# Altium project InactivityTracker.PrjPcb
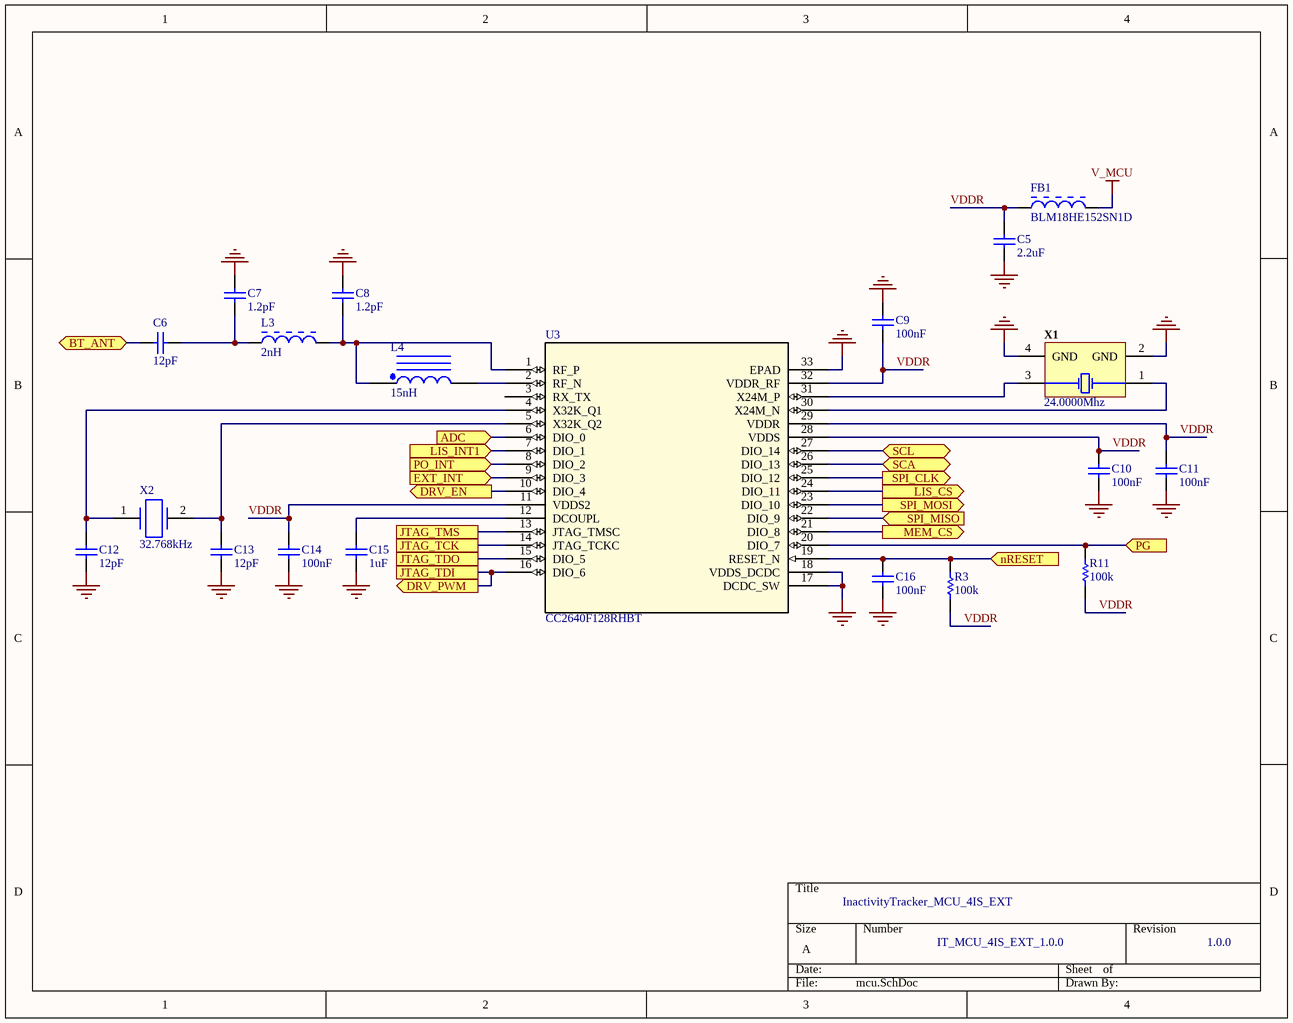
[diagram p0: mcu.SchDoc]
7 sheets, 68 parts. Net scope: flat (ports and power ports of the same name join across sheets).
Board files: InactivityTracker.PcbDoc, InactivityTracker_rev4_pcituremode.PcbDoc
Sheets:
  mcu.SchDoc
  power-dist.SchDoc
  lipo-charger.SchDoc
  pulseox.SchDoc
  peripherals.SchDoc
  hid.SchDoc
  memory.SchDoc

## Sheet mcu.SchDoc
size A

### Parts
C5  2.2uF  [CAPC1005X55X25ML05T10]
C6  12pF  [CAPC1005X55X25NL05T10]
C7  1.2pF  [CAPC1005X55X25ML05T10]
C8  1.2pF  [CAPC1005X55X25ML05T10]
C9  100nF  [CAPC1005X55X25NL05T10]
C10  100nF  [CAPC1005X55X25NL05T10]
C11  100nF  [CAPC1005X55X25NL05T10]
C12  12pF  [CAPC1005X55X25NL05T10]
C13  12pF  [CAPC1005X55X25NL05T10]
C14  100nF  [CAPC1005X55X25NL05T10]
C15  1uF  [CAPC1005X55X25NL5T10]
C16  100nF  [CAPC1005X55X25NL05T10]
FB1  BLM18HE152SN1D  [MURA-BLM18-RF-H4-CHIP-2_V]
L3  2nH  [MURA-IND0402_V]
L4  15nH  [INDC1005X55X25ML05T10_A]
R3  100k  [RESC1005X40X25ML05T05]
R11  100k  [RESC1005X40X25ML05T05]
U3  CC2640F128RHBT  [RHB32_3P45X3P45]
X1  24.0000Mhz  [EPSON-TSX-3225_V]
X2  32.768kHz  [XTAL320X150X75]

### Ports
ADC (in), BT_ANT (bidir), DRV_EN (out), DRV_PWM (out), EXT_INT (in), JTAG_TCK, JTAG_TDI, JTAG_TDO, JTAG_TMS, LIS_CS (out), LIS_INT1 (in), MEM_CS (out), nRESET (in), PG (in), PO_INT (in), SCA (bidir), SCL (bidir), SPI_CLK (out), SPI_MISO (in), SPI_MOSI (out)

### Nets
GND: C5.2 C7.1 C8.1 C9.2 C10.1 C11.1 C12.1 C13.1 C14.1 C15.2 C16.1 U3.17(DCDC_SW) U3.18(VDDS_DCDC) U3.33(EPAD) X1.2(GND) X1.4(GND)
V_MCU: FB1.2
VDDR: C5.1 C9.1 C10.2 C11.2 C14.2 FB1.1 R3.2 R11.2 U3.11(VDDS2) U3.28(VDDS) U3.29(VDDR) U3.32(VDDR_RF)
NetAE1_1: C6.1 ; port BT_ANT
NetC6_2: C6.2 C7.2 L3.1
NetC8_2: C8.2 L3.2 L4.1 U3.1(RF_P)
NetC12_2: C12.2 U3.4(X32K_Q1) X2.1
NetC13_2: C13.2 U3.5(X32K_Q2) X2.2
NetC15_1: C15.1 U3.12(DCOUPL)
NetC16_2: C16.2 R3.1 U3.19(RESET_N) ; port nRESET
NetL4_2: L4.2 U3.2(RF_N)
NetP3_1: U3.26(DIO_13) ; port SCA
NetP3_2: U3.27(DIO_14) ; port SCL
NetP3_5: U3.8(DIO_2) ; port PO_INT
NetP4_1: U3.9(DIO_3) ; port EXT_INT
NetP5_1: U3.13(JTAG_TMSC) ; port JTAG_TMS
NetP5_2: U3.14(JTAG_TCKC) ; port JTAG_TCK
NetP5_3: U3.15(DIO_5) ; port JTAG_TDO
NetP5_4: U3.16(DIO_6) ; port JTAG_TDI, port DRV_PWM
NetR1_2: U3.6(DIO_0) ; port ADC
NetR11_1: R11.1 U3.20(DIO_7) ; port PG
NetU3_7: U3.7(DIO_1) ; port LIS_INT1
NetU3_10: U3.10(DIO_4) ; port DRV_EN
NetU3_21: U3.21(DIO_8) ; port MEM_CS
NetU3_22: U3.22(DIO_9) ; port SPI_MISO
NetU3_23: U3.23(DIO_10) ; port SPI_MOSI
NetU3_24: U3.24(DIO_11) ; port LIS_CS
NetU3_25: U3.25(DIO_12) ; port SPI_CLK
NetU3_30: U3.30(X24M_N) X1.1(X1)
NetU3_31: U3.31(X24M_P) X1.3(X2)

Not connected (* = marked no-connect by the designer): U3 3(RX_TX)

### Notes on the sheet
- InactivityTracker_MCU_4IS_EXT
- IT_MCU_4IS_EXT_1.0.0
- 1.0.0

### Library data of the parts
C5 = CMP-2008-04543-1: Part Number: GRM155R60J225ME15D; Manufacturer: Murata
C6 C12 C13 = CMP-2008-04258-1: Part Number: GRM1555C1H120JA01D; Manufacturer: Murata
C7 C8 = CMP-2008-04281-1: Manufacturer: Murata; Part Number: GRM1555C1H1R2CA01D
C9-C11 C14 C16 = CMP-2008-04639-1: Part Number: GRM155R71H104KE14D; Manufacturer: Murata
C15 = CMP-1662-00020-1: Chip Capacitor, 1 uF, +/- 10%, 6.3 V, -55 to 85 degC, 0402 (1005 Metric), RoHS, Tape and Reel; PartNumber: GRM155R60J105KE19D; Voltage Rating (DC): 3 V; Type (Capacitors): X5R; Voltage Rating: 6.3 V; ComponentLink2Description: Datasheet; ComponentLink2URL: http://psearch.en.murata.com/capacitor/product/GRM155R60J105KE19%23.pdf; Max Operating Temperature: 85 degC; Min Operating Temperature: -55 degC; Package Quantity: 10000; Mounting Technology: Surface Mount; ComponentLink1Description: Manufacturer URL; ComponentLink1URL: http://www.murata.com/; PackageDescription: 2-Pin Surface Mount Device, Body 1 x 0.5 mm; Tolerance: 10%; Case/Package: 0402; Mount: Surface Mount; Packaging: Tape and Reel; Case Code (Metric): 1005; Radiation Hardening: No; Width: 0.5 mm; Length: 1 mm; DatasheetVersion: 08/2016; Height: 0.5 mm; Capacitance: 1 uF; RoHSCompliant: true; Case Code (Imperial): 0402; REACH SVHC: No SVHC; Pins: 2
FB1 = CMP-0686-00368-2: Chip Ferrite Bead for GHz Band High-speed Signal Lines, 1500 Ohm, 500 mA, -55 to 125 degC, 1.6 x 0.8 x 0.95 mm SMD, Tape and Reel; Manufacturer: Murata; Rated Current: 500 mA; Impedance (at 100 MHz): 1500 Ohm +/- 25%; DC Resistance: 0.50 Ohm Max.; Packing: Tape and Reel; DatasheetVersion: 08/2013; ComponentLink1URL: http://www.murata.com/; Mounting Technology: Surface Mount; ComponentLink2URL: http://www.murata.com/products/catalog/pdf/c31e.pdf; ComponentLink3Description: Package Specification; ComponentLink2Description: Datasheet; PackageReference: BLM18_H950-2; ComponentLink1Description: Manufacturer URL; PackageDescription: 2-Pin Chip, Body 1.6 x 0.8 mm; ComponentLink3URL: http://www.murata.com/products/catalog/pdf/c31e.pdf; PartNumber: BLM18HE152SN1D; Operating Temperature Range: -55 to 125 degC
L3 = CMP-0499-00001-3: Chip Inductor (Chip Coil) for High Frequency Multilayer, 2 +/- 0.3 nH, 300 mA, 0402 (1005), 180mm Paper Tape; Manufacturer: Murata; PartNumber: LQG15HS2N0S02D; Self Resonance Frequency (min.): 6000 MHz; Inductance Test Frequency: 100 MHz; Inductance: 2.0 nH +/- 0.3 nH; Rated Current (Itemp) (Based on Temperature rise): 300 mA; Max. Of DC Resistance: 0.1 ohm; Q (min.): 8; Operating Temperature Range: -55 to 125 degC; Mounting Technology: Surface Mount; PackageDescription: 2-Pin SMT Inductor, 1 x 0.5 mm Body; ComponentLink2URL: http://search.murata.co.jp/Ceramy/image/img/PDF/ENG/L0075S0083LQG15HS.pdf; ComponentLink1Description: Manufacturer URL; ComponentLink3URL: http://search.murata.co.jp/Ceramy/image/img/PDF/ENG/L0075S0083LQG15HS.pdf; ComponentLink1URL: http://www.murata.com/; ComponentLink2Description: Datasheet; RoHS: Yes; ComponentLink3Description: Package Specification; Q Test Frequency: 100 MHz; PackageReference: IND0402
L4 = CMP-2100-03652-1: Chip Inductor, 15 nH, +/- 5%, 100 MHz, -55 to 125 degC, 0402 (1005 Metric), RoHS, Paper Tape; Manufacturer: Murata; DC Current: 300mA; Q Factor: 8; Self Resonant Frequency: 2.5GHz; DC Resistance (DCR): 320mOhm; Test Frequency: 100MHz; Shielding: Unshielded; Core Material: Air; Lead Free: LeadFree; Package Quantity: 10000; Package Description: 2-Pin Surface Mount Device, Body 1 x 0.5 mm; Case Code (Imperial): 0402; Termination: SMD/SMT; Datasheet URL: http://psearch.en.murata.com/inductor/product/LQG15HS15NJ02_.pdf; Case Code (Metric): 1005; Tolerance: 5%; Min Operating Temperature: -55degC; Radiation Hardening: No; Width: 0.02inch; Current Rating: 300mA; Packaging: TapeandReel; Height: 0.5mm; Manufacturer URL: http://www.murata.com/; Case/Package: 0402; Max DC Current: 300mA; Height - Seated (Max): 0.022inch; Package Reference: 0402; Length: 1mm; Max Operating Temperature: 125degC; Military Standard: Not; Datasheet Version: 42675.0; Depth: 0.55mm; Inductance: 15nh; RoHSCompliant: true
R3 R11 = CMP-2002-08123-2: Chip Resistor, 100 KOhm, +/- 1%, 0.63 W, -55 to 155 degC, 0402 (1005 Metric), RoHS, Tape and Reel; Voltage Rating: 50 V; Type (Resistor): Thick Film; Power Rating: 63 mW; Case\Package: 0402; Mount: Surface Mount; Packaging: Tape and Reel; Weight: 2.3E-05 oz; PackageDescription: 2-Pin Surface Mount Device, Body 1 x 0.5 mm; ComponentLink1Description: Manufacturer URL; ComponentLink2Description: Datasheet; Min Operating Temperature: -55 degC; Width: 0.5 mm; Resistance: 100 kohm; REACH SVHC: Unknown; ComponentLink2URL: http://www.vishay.com/docs/20035/dcrcwe3.pdf; Package Quantity: 10000; Mounting Technology: Surface Mount; PackageReference: 0402; ComponentLink1URL: http://www.vishay.com/; Max Operating Temperature: 155 degC; Length: 1 mm; DatasheetVersion: 06/2012; Height: 0.35 mm; Case Code (Imperial): 0402; Pins: 2; Tolerance: 1%; Case Code (Metric): 1005; Radiation Hardening: No; RoHSCompliant: true
U3 = CC2640F128RHBT: SimpleLink Wireless MCU; Vendor: Texas Instruments; Built_By: EMA_Jessica; Manufacturer_Part_Number: CC2640F128RHBT; Copyright: Copyright (C) 2018 Accelerated Designs. All rights reserved; RefDes: RefDes; Type: DEV; Value: Value
X1 = CMP-2000-07333-1: MHz Range Crystal, 24 MHz, -40 to 85 degC, 4-Pin SMD, RoHS, Tape and Reel; Manufacturer: Epson; Brand: EpsonTiming; Frequency Stability: 10PPM; Frequency: 24MHz; ESR: 40Ohms; Load Capacitance: 9pF; Unit Weight: 0.000564oz; Drive Level: 200uW; Datasheet Version: 12/2015; RoHS: True; Operating Temperature Range: -40Cto+85C; Length: 3.2mm; Tolerance: 10PPM; Width: 2.5mm; Mounting Technology: SurfaceMount; Package Description: 4-Pin Surface Mount Device, Body 3.2 x 2.5 mm; Manufacturer URL: https://www.eea.epson.com/; Factory Pack Quantity: 250; Package Reference: TSX-3225; Height: 0.6mm; Mounting Style: SMD/SMT; Termination Style: SMD/SMT; Datasheet URL: https://support.epson.biz/td/api/doc_check.php?dl=brief_FA-238V_en.pdf; Type: Crystal; Series: TSX-3225; Package / Case: 3.2mmx2.5mm; Product Category: Crystals; Packaging: Reel
X2 = 9HT10-32.768KDZY-T: TXC - 9HT10-32.768KDZY-T - CRYSTAL, 32.768KHZ, 7PF, 3.2 X 1.5MM; Tolerance: 20ppm; ESR (Equivalent Series Resistance): 70kR; Supplier 1: Digi-Key; Manufacturer: TXC; Manufacturer Part Number: 9HT10-32.768KDZY-T; RoHS: Yes; Category: Crystals; Stock 1: 3909; Pricing 1: 1=0.66000, 10=0.55000, 50=0.49500, 100=0.44000, 500=0.41800, 1000=0.35200 (USD); Mount: Surface Mount; Case/Package: SMD/SMT; Number of Pins: 2; Min Operating Temperature: -40°C; Max Operating Temperature: 85°C; Termination: SMD/SMT; Package Quantity: 1; Frequency: 32.768kHz; Load Capacitance: 7pF; Packaging: Tape and Reel; Frequency Tolerance: 20ppm; Length: 0.126inch; Height: 0.033inch; Width: 1.5mm; Lead Free: Lead Free; REACH SVHC: No SVHC; ComponentLink1URL: https://datasheet.ciiva.com/856/9ht10-856052.pdf?src-supplier=Digi-Key; ComponentLink1Description: https://datasheet.ciiva.com/856/9ht10-856052.pdf?src-supplier=Digi-Key; ComponentLink2URL: https://datasheet.ciiva.com/856/9ht10-856053.pdf?src-supplier=Digi-Key; ComponentLink2Description: https://datasheet.ciiva.com/856/9ht10-856053.pdf?src-supplier=Digi-Key; ComponentLink3URL: https://datasheet.ciiva.com/8047/9ht10-8047909.pdf?src-supplier=Element14; ComponentLink3Description: https://datasheet.ciiva.com/8047/9ht10-8047909.pdf?src-supplier=Element14; ComponentLink4URL: https://datasheet.ciiva.com/856/9ht10-856054.pdf?src-supplier=Digi-Key; ComponentLink4Description: https://datasheet.ciiva.com/856/9ht10-856054.pdf?src-supplier=Digi-Key; Supplier Part Number 1: 887-1506-1-ND

## Sheet power-dist.SchDoc
size A
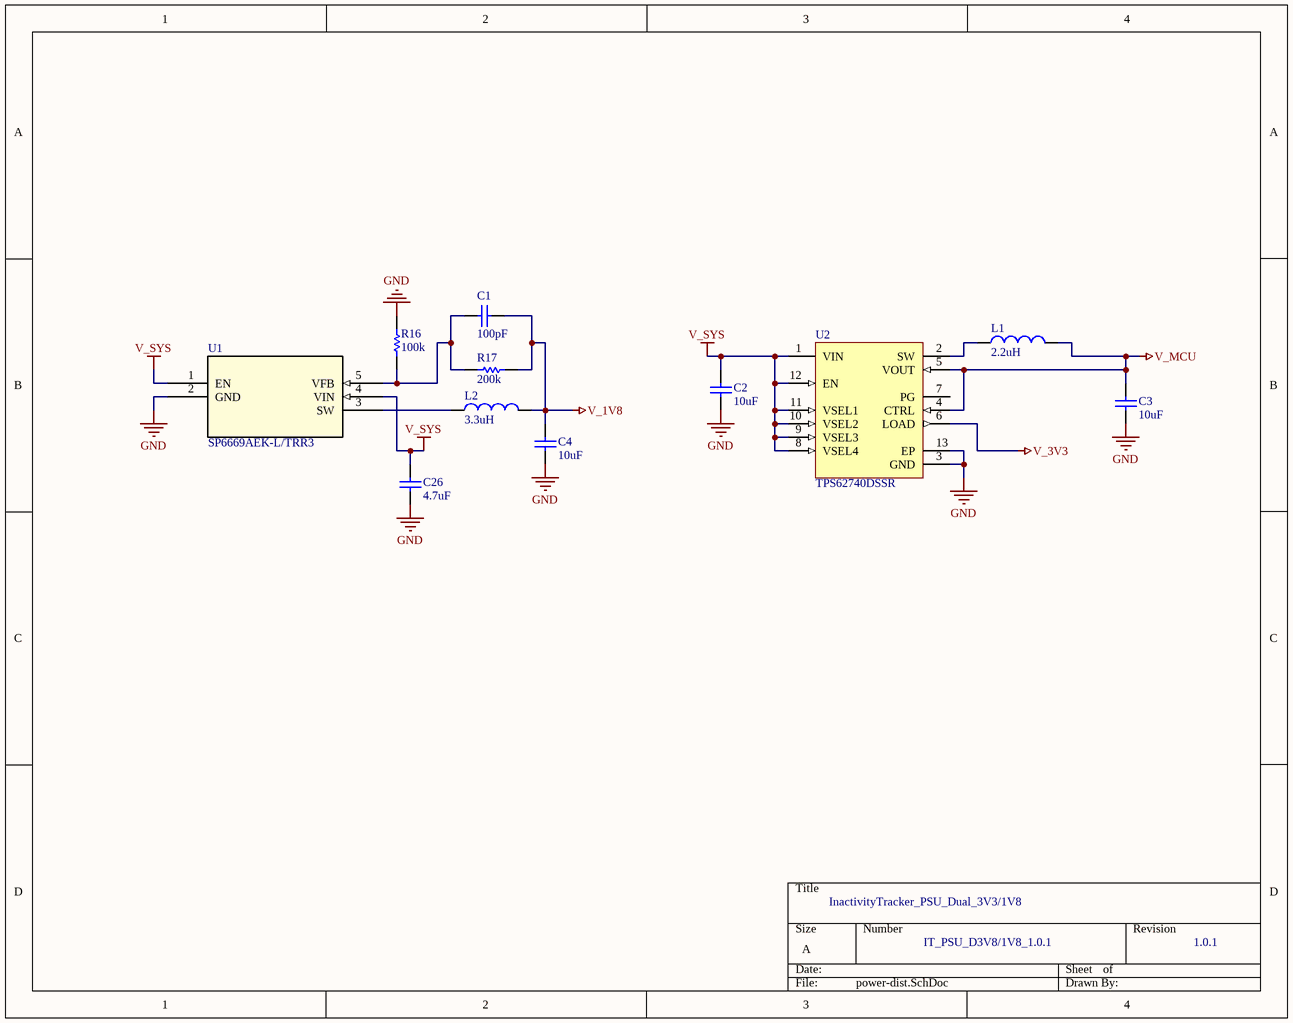
[diagram p1: power-dist.SchDoc]

### Parts
C1  100pF  [CAPC1005X55X25ML05T10]
C2  10uF  [CAPC1005X55X25NL05T10]
C3  10uF  [CAPC1005X55X25NL05T10]
C4  10uF  [CAPC1005X55X25NL05T10]
C26  4.7uF  [CAPC1005X55X25NL05T10]
L1  2.2uH  [MURA-IND0805_H_0.55_L]
L2  3.3uH  [INDC2012X100N]
R16  100k  [RESC1005X40X25ML05T05]
R17  200k  [RESC1005X40X25ML05T05]
U1  SP6669AEK-L/TRR3  [SOT-23-5_VAR-AA]
U2  TPS62740DSSR  [DSS0012A_V]

### Nets
GND: C2.2 C3.2 C4.2 C26.2 R16.1 U1.2(GND) U2.3(GND) U2.13(EP)
V_1V8: C1.2 C4.1 L2.2 R17.2
V_3V3: U2.6(LOAD)
V_MCU: C3.1 L1.2 U2.4(CTRL) U2.5(VOUT)
V_SYS: C2.1 C26.1 U1.1(EN) U1.4(VIN) U2.1(VIN) U2.8(VSEL4) U2.9(VSEL3) U2.10(VSEL2) U2.11(VSEL1) U2.12(EN)
NetC1_1: C1.1 R16.2 R17.1 U1.5(VFB)
NetL1_1: L1.1 U2.2(SW)
NetL2_1: L2.1 U1.3(SW)

Not connected (* = marked no-connect by the designer): U2 7(PG)

### Notes on the sheet
- InactivityTracker_PSU_Dual_3V3/1V8
- IT_PSU_D3V8/1V8_1.0.1
- 1.0.1

### Library data of the parts
C1 = CMP-2008-04249-1: Manufacturer: Murata; Part Number: GRM1555C1H101GA01D
C2-C4 = CMP-2008-04556-1: Part Number: GRM155R61A105KE15D; Manufacturer: Murata
C26 = CMP-2008-03967-1: Manufacturer: Murata; Part Number: GRM155R61C102KA01D
L1 = CMP-2000-06589-1: Chip Inductor, 1.0 uH, +/- 20%, -55 to 125 degC, 2-Pin SMD (0805), RoHS, Tape and Reel; Manufacturer: Murata; Rated Current-Max: 800mA; Inductance-Nom: 1H; DC Resistance: 0.19; Mounting Technology: SurfaceMount; Package Reference: 0805; Tolerance (%): 20%; Datasheet Version: 07/2014; Manufacturer URL: http://www.murata.com/; Package Description: 2-Pin Surface Mounted Device, Body 2 x 1.25 mm; Case Size/Dimension: 0805; Datasheet URL: https://datasheet.ciiva.com/3866/336lqm21pn1r0mc023-3866307.pdf
L2 = LQM21PN3R3NGRD: Inductor with Inductance: 3.3uH Tol. +/-30%, Package: 0805 _2012_; MF: Murata; Digi-Key_Purchase_URL: https://www.digikey.com/product-detail/en/murata-electronics/LQM21PN3R3NGRD/490-11718-1-ND/5333558?utm_source=snapeda&utm_medium=aggregator&utm_campaign=symbol; Value: *; Digi-Key_Part_Number: 490-11718-1-ND; SnapEDA_Link: https://www.snapeda.com/parts/LQM21PN3R3NGRD/Murata%20Electronics%20North%20America/view-part/1523369/?ref=snap; Package: 2012 Murata; MP: LQM21PN3R3NGRD
R16 = CMP-2002-08123-2: as R3 on sheet mcu; Mount: Surface Mount; Packaging: Tape and Reel; Weight: 2.3E-05 oz; PackageDescription: 2-Pin Surface Mount Device, Body 1 x 0.5 mm; ComponentLink1Description: Manufacturer URL; ComponentLink2Description: Datasheet; Min Operating Temperature: -55 degC; Width: 0.5 mm; Resistance: 100 kohm; REACH SVHC: Unknown; ComponentLink2URL: http://www.vishay.com/docs/20035/dcrcwe3.pdf; Package Quantity: 10000; Mounting Technology: Surface Mount; PackageReference: 0402; ComponentLink1URL: http://www.vishay.com/; Max Operating Temperature: 155 degC; Length: 1 mm; DatasheetVersion: 06/2012; Height: 0.35 mm; Case Code (Imperial): 0402; Pins: 2; Tolerance: 1%; Case Code (Metric): 1005; Radiation Hardening: No; RoHSCompliant: true
R17 = CMP-2002-08351-1: Part Number: CRCW0402200RFKED; Manufacturer: Vishay Dale
U1 = SP6669AEK-L/TRR3: Buck Switching Regulator IC Positive Adjustable 0.6V 1 Output 600mA SC-74A, SOT-753; Vendor: Exar; Built_By: EMA_Jessica; Manufacturer_Part_Number: SP6669AEK-L/TRR3; Copyright: Copyright (C) 2018 Accelerated Designs. All rights reserved; RefDes: RefDes; Type: DEV; Value: Value
U2 = CMP-0323-00572-2: Step Down Converter For Low Power Applications, 2.2 to 5.5 V VIN, -40 to 85 degC, 12-Pin WSON (DSS), RoHS, Tape and Reel; VOUT Max: 3.3 V; VIN Min: 2.2 V; VIN Max: 5.5 V; VOUT Min: 1.8 V; ComponentLink1URL: http://www.ti.com/; PackageReference: DSS0012A; ComponentLink2URL: http://www.ti.com/lit/ds/symlink/tps62740.pdf; Packing: Tape and Reel; DatasheetVersion: SLVSB02B; ComponentLink3Description: Package Specification; Temperature Max: 85 degC; RoHS: TRUE; PartNumber: TPS62740; PackageVersion: 4209244/C, 07/2011; PackageDescription: 12-Pin Plastic Small Outline, Body 3 x 2 mm, Pitch 0.5 mm; Mounting Technology: Surface Mount; ComponentLink1Description: Manufacturer URL; Temperature Min: -40 degC; ComponentLink2Description: Datasheet; ComponentLink3URL: http://www.ti.com/litv/pdf/mpds336b

## Sheet lipo-charger.SchDoc
size A
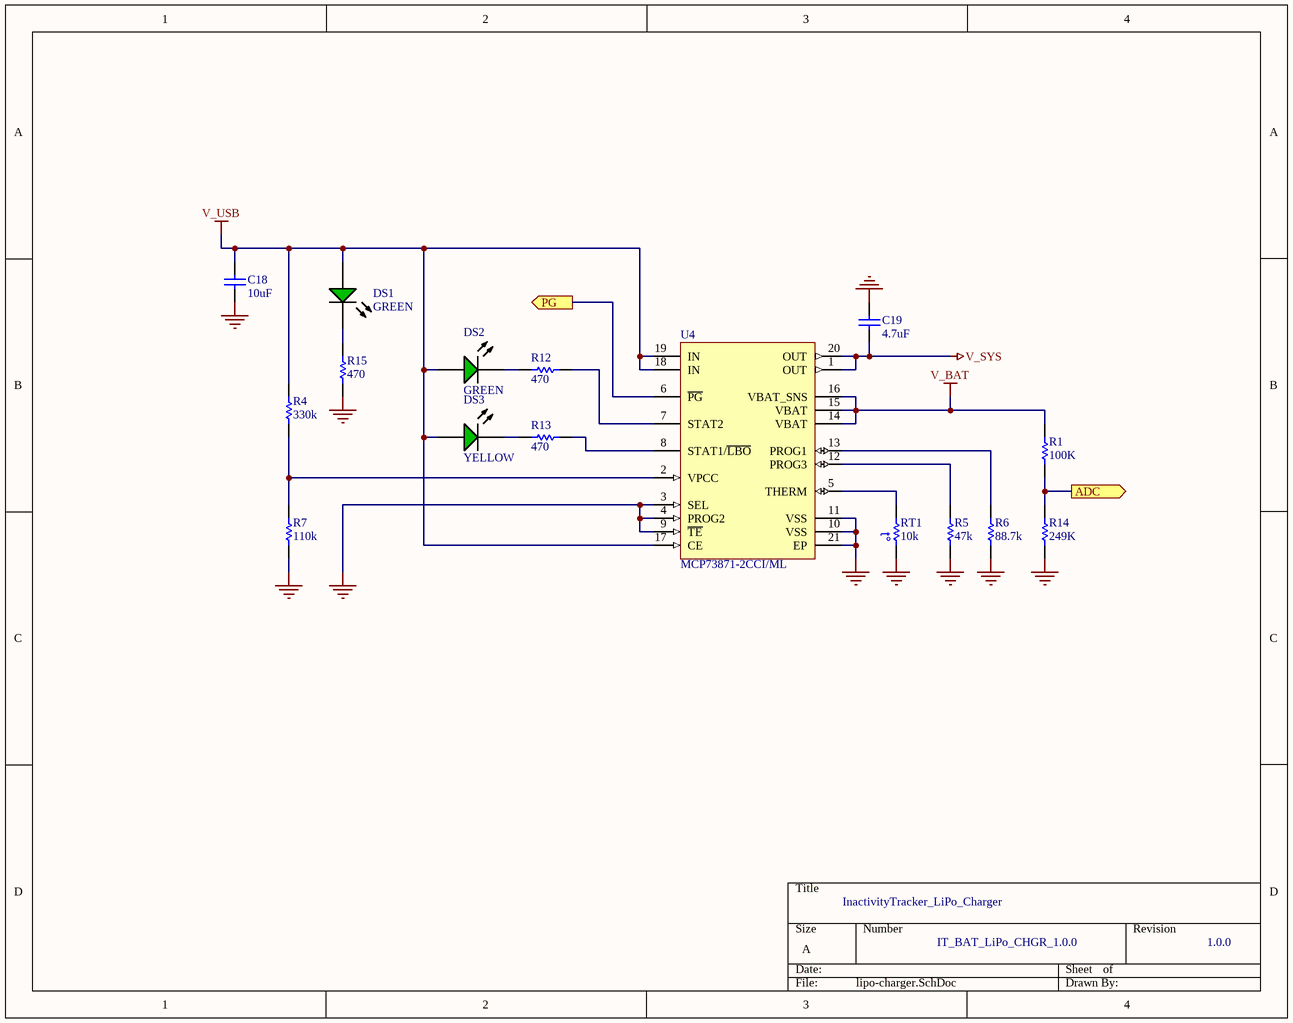
[diagram p2: lipo-charger.SchDoc]

### Parts
C18  10uF  [CAPC1005X55X25NL05T10]
C19  4.7uF  [CAPC1005X55X25NL05T10]
DS1  GREEN  [LITE-ON-LTST-C190GKT-2_V]
DS2  GREEN  [LITE-ON-LTST-C190GKT-2_V]
DS3  YELLOW  [LITE-ON-LTST-C190GKT-2_V]
R1  100K  [RESC1005X40X25ML05T05]
R4  330k  [RESC1005X40X25NL05T05]
R5  47k  [RESC1005X40X25LL05T05]
R6  88.7k  [RESC1005X40X25NL05T05]
R7  110k  [RESC1005X40X25NL05T05]
R12  470  [RESC1005X40X25ML05T05]
R13  470  [RESC1005X40X25ML05T05]
R14  249K  [RESC1005X40X25NL05T05]
R15  470  [RESC1005X40X25ML05T05]
RT1  10k  [MURA-NCP18XH103F03RB-2_V]
U4  MCP73871-2CCI/ML  [QFN-ML20_M]

### Ports
ADC (out), PG (out)

### Nets
GND: C18.2 C19.2 R5.2 R6.1 R7.2 R14.2 R15.2 RT1.2 U4.3(SEL) U4.4(PROG2) U4.9(~{TE}) U4.10(VSS) U4.11(VSS) U4.21(EP)
V_BAT: R1.1 U4.14(VBAT) U4.15(VBAT) U4.16(VBAT_SNS)
V_SYS: C19.1 U4.1(OUT) U4.20(OUT)
V_USB: C18.1 DS1.1(A) DS2.1(A) DS3.1(A) R4.1 U4.17(CE) U4.18(IN) U4.19(IN)
NetDS1_2: DS1.2(K) R15.1
NetDS2_2: DS2.2(K) R12.1
NetDS3_2: DS3.2(K) R13.1
NetR1_2: R1.2 R14.1 ; port ADC
NetR4_2: R4.2 R7.1 U4.2(VPCC)
NetR5_1: R5.1 U4.12(PROG3)
NetR6_2: R6.2 U4.13(PROG1)
NetR11_1: U4.6(~{PG}) ; port PG
NetR12_2: R12.2 U4.7(STAT2)
NetR13_2: R13.2 U4.8(STAT1/~{LBO})
NetRT1_1: RT1.1 U4.5(THERM)

### Notes on the sheet
- InactivityTracker_LiPo_Charger
- IT_BAT_LiPo_CHGR_1.0.0
- 1.0.0
- (in symbol CMP-2000-05271-1) t°

### Library data of the parts
C18 = CMP-2008-04556-1: as C2 on sheet power-dist
C19 = CMP-2008-03967-1: as C26 on sheet power-dist
DS1-DS3 = CMP-2000-05197-1: LED Uni-Color Green, 75 mW, 5 V, -30 to 85 degC, 2-Pin SMD, RoHS, Tape and Reel; Manufacturer: Lite-On; Reverse Voltage: 5V; Product Depth (mm): 0.8mm; Forward Voltage: 2.4V; Rad Hardened: No; High Brightness: Yes; Forward Current: 30mA; Viewing Angle: 130deg; Test Current (It): 20mA; Emitting Color: YellowGreen; Number of Elements: 1; Luminous Intensity: 35mcd; Chip Material: AlGaInP; Shape Type: Rectangular; Dominant Wave Length: 571nm; Peak Wavelength: 574nm; Main Category: ChipLED; DELETED: Compliant; Product Length (mm): 1.6mm; Power Dissipation: 75W; Package Reference: C190KGKT; Mounting: SurfaceMount; Package Description: 2-Pin Surface Mount Device, Body 1.6 x 0.8 mm; Datasheet Version: Jul-15; Operating Temperature Classification: Industrial; Packaging: TapeandReel; Lens Dimensions: 1.1X0.8X0.52mm; Type: Uni-Color; Manufacturer URL: http://www.us.liteon.com/; Datasheet URL: http://datasheet.octopart.com/LTST-C190KGKT-Lite-On-datasheet-43775815.pdf; Product Height (mm): 0.8mm; Operating Temp Range: -55Cto85C; Pin Count: 2; Package Type: ChipLed; Lum Intensity: 35mcd
R1 = CMP-2002-08123-2: as R3 on sheet mcu; Mount: Surface Mount; Packaging: Tape and Reel; Weight: 2.3E-05 oz; PackageDescription: 2-Pin Surface Mount Device, Body 1 x 0.5 mm; ComponentLink1Description: Manufacturer URL; ComponentLink2Description: Datasheet; Min Operating Temperature: -55 degC; Width: 0.5 mm; Resistance: 100 kohm; REACH SVHC: Unknown; ComponentLink2URL: http://www.vishay.com/docs/20035/dcrcwe3.pdf; Package Quantity: 10000; Mounting Technology: Surface Mount; PackageReference: 0402; ComponentLink1URL: http://www.vishay.com/; Max Operating Temperature: 155 degC; Length: 1 mm; DatasheetVersion: 06/2012; Height: 0.35 mm; Case Code (Imperial): 0402; Pins: 2; Tolerance: 1%; Case Code (Metric): 1005; Radiation Hardening: No; RoHSCompliant: true
R4 = CMP-2002-08521-1: Manufacturer: Vishay Dale; Part Number: CRCW0402330KFKED
R5 = CMP-2002-00026-1: Manufacturer: Vishay Dale; Part Number: CRCW040247K0JNED
R6 = CMP-2002-00251-1: Manufacturer: Vishay Dale; Part Number: CRCW040288K7FKED
R7 = CMP-2002-08148-1: Manufacturer: Vishay Dale; Part Number: CRCW0402110KFKED
R12 R13 R15 = CMP-2002-00023-1: Part Number: CRCW0402470RJNED; Manufacturer: Vishay Dale
R14 = CMP-2002-08401-1: Part Number: CRCW0402249KFKED; Manufacturer: Vishay Dale
RT1 = CMP-2000-05271-1: NTC Thermistor, 10 KOhm, +/- 1%, 0.1 W, -40 to 125 degC, 0603 (1608 Metric), RoHS, Tape and Reel; Manufacturer: Murata; B-constant: 3434K; Resistance: 10kO; Rated Current: 310A; Datasheet URL: http://www.jameco.com/Jameco/Products/ProdDS/1870999.pdf; Datasheet Version: Apr-05; Temperature Range: -40to+125degC; Tolerance (%): ±1%; Manufacturer URL: http://www.murata.com/; Type: NTC
U4 = CMP-0133-00005-1: Stand-Alone System Load Sharing and Li-Ion/Li-Polymer Battery Charge Management Controller, 4.2V, 20-Pin QFN, Industrial Temperature; PackageDescription: 20-Lead Plastic Quad Flat, No Lead Package (ML) - 4x4x0.9 mm Body [QFN]; PackageReference: QFN-ML20; PackageVersion: revBB, Aug-2009; DatasheetVersion: revB, May-2009

## Sheet pulseox.SchDoc
size A
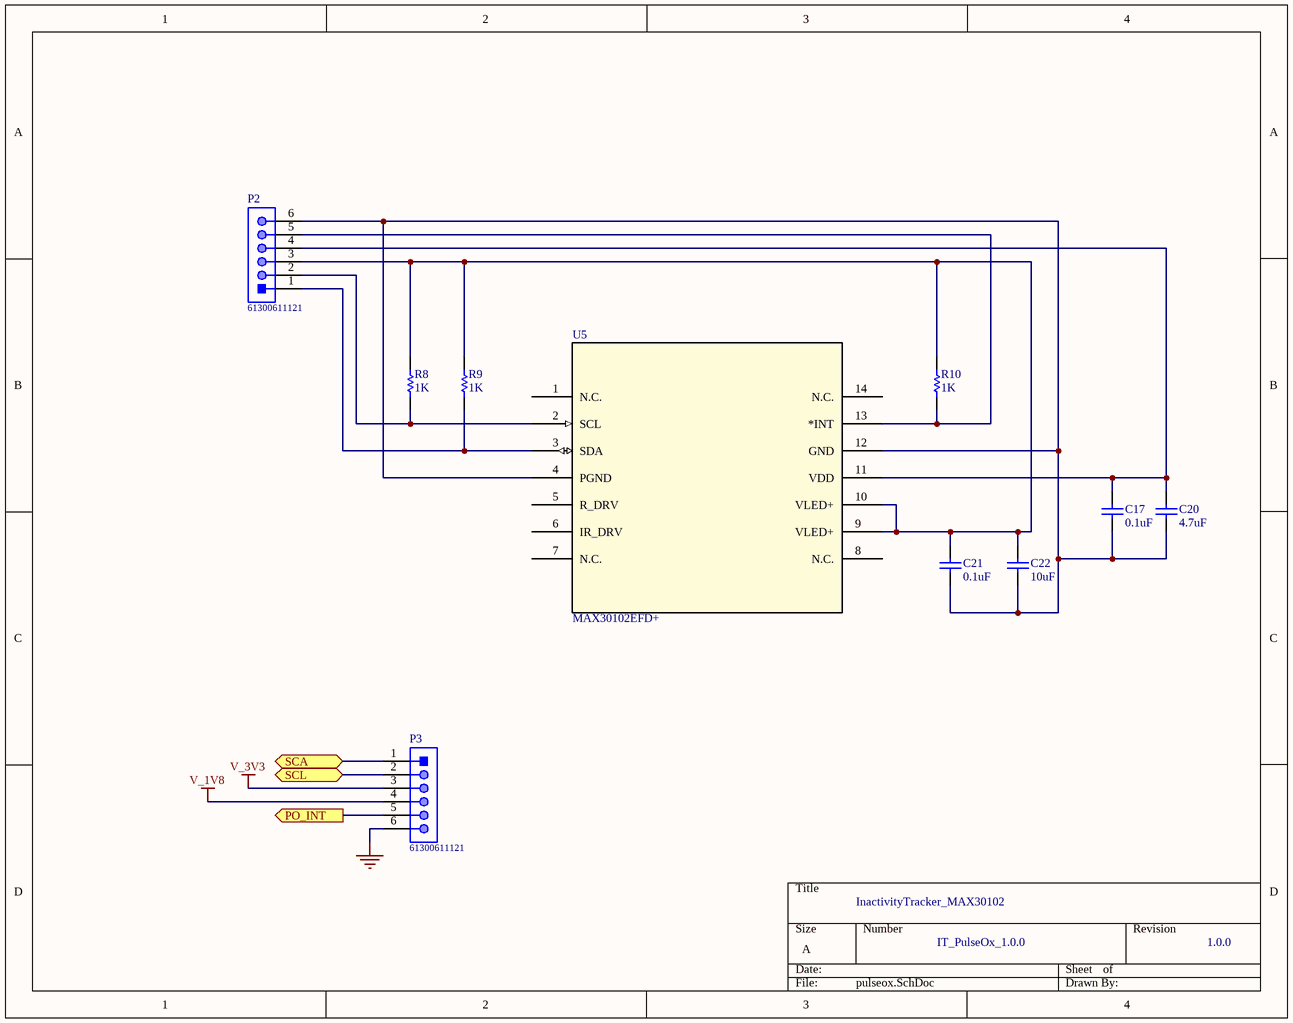
[diagram p3: pulseox.SchDoc]

### Parts
C17  0.1uF  [CAPC1005X55X25ML05T10]
C20  4.7uF  [CAPC1005X55X25NL05T10]
C21  0.1uF  [CAPC1005X55X25ML05T10]
C22  10uF  [CAPC1608X90X35NL10T15]
P2  61300611121  [61300611121]
P3  61300611121  [61300611121]
R8  1K  [RESC1005X40X25NL05T05]
R9  1K  [RESC1005X40X25NL05T05]
R10  1K  [RESC1005X40X25NL05T05]
U5  MAX30102EFD+  [21-0880B-L]

### Ports
PO_INT (out), SCA (bidir), SCL (bidir)

### Nets
GND: P3.6
V_1V8: P3.4
V_3V3: P3.3
NetC17_1: C17.1 C20.1 P2.4 U5.11(VDD)
NetC17_2: C17.2 C20.2 C21.2 C22.2 P2.6 U5.4(PGND) U5.12(GND)
NetC21_1: C21.1 C22.1 P2.3 R8.2 R9.2 R10.1 U5.9(VLED+) U5.10(VLED+)
NetP2_1: P2.1 R9.1 U5.3(SDA)
NetP2_2: P2.2 R8.1 U5.2(SCL)
NetP2_5: P2.5 R10.2 U5.13(*INT)
NetP3_1: P3.1 ; port SCA
NetP3_2: P3.2 ; port SCL
NetP3_5: P3.5 ; port PO_INT

Not connected (* = marked no-connect by the designer): U5 1(N.C.) 5(R_DRV) 6(IR_DRV) 7(N.C.) 8(N.C.) 14(N.C.)

### Notes on the sheet
- InactivityTracker_MAX30102
- IT_PulseOx_1.0.0
- 1.0.0

### Library data of the parts
C17 C21 = CMP-2100-03641-1: Chip Capacitor, 0.1 uF, +/- 10%, 16 V, -55 to 125 degC, 0402 (1005 Metric), RoHS, Tape and Reel; Manufacturer: Murata; Material: Ceramic; Insulation Resistance: 10GR; Voltage: 16V; Dielectric: X7R; Capacitance: 100nF; REACH SVHC: NoSVHC; Depth: 0.5mm; Case/Package: 0402; Datasheet URL: http://psearch.en.murata.com/capacitor/product/GRM155R71C104KA88%23.pdf; Lead Free: LeadFree; Dielectric Material: Ceramic; Manufacturer URL: http://www.murata.com/; Min Operating Temperature: -55degC; Length: 1mm; Case Code (Metric): 1005; Radiation Hardening: No; Package Reference: 0402; RoHSCompliant: true; Datasheet Version: 42675.0; Thickness: 0.022inch; Packaging: TapeandReel; Voltage Rating (DC): 16V; Tolerance: 10%; Max Operating Temperature: 125degC; Package Description: 2-Pin Surface Mount Device, Body 1 x 0.5 mm; Mount: SurfaceMount; Height: 0.5mm; Width: 0.5mm; Number of Pins: 2; Voltage Rating: 16V; Case Code (Imperial): 0402; Termination: SMD/SMT; Package Quantity: 1
C20 = CMP-2008-04549-1: Part Number: GRM155R60J475ME47D; Manufacturer: Murata
C22 = CMP-2006-02792-1: Part Number: GRM188R60J106ME47D; Manufacturer: Murata
P2 P3 = CMP-1502-01070-1: THT Vertical Pin Header WR-PHD, Pitch 2.54 mm, Single Row, 6 pins; Manufacturer: Wurth Elektronik; Gender: Male; Pin Number: 6; Pitch: 2.54mm; Working Voltage: 250VAC; Rated Current: 3A; Withstanding Voltage: 500VAC; Contact Resistance: 20mOhm; Operating Temperature: -40to105degC; Packaging: Bag; Datasheet URL: https://katalog.we-online.de/em/datasheet/6130xx11121.pdf; Package Reference: 61300611121; Mounting Technology: THT; Publisher: WurthElektronik; Part Number: 61300611121; Manufacturer URL: http://www.we-online.de; Row Number: Single; Orientation: Vertical
R8-R10 = CMP-2002-08276-1: Manufacturer: Vishay Dale; Part Number: CRCW04021K00FKED
U5 = MAX30102EFD+: IC SENSOR OXIMETER/HEARTRATE; Manufacturer: Maxim; Min Supply Voltage: 1.7V; Max Supply Voltage: 2V; Supplier 1: Digi-Key; Manufacturer Part Number: MAX30102EFD+; RoHS: Yes; Category: Decoders, Multiplexers; Stock 1: 798; Pricing 1: 1=9.76000, 10=8.81500, 25=8.40520, 100=7.29800, 500=6.35500, 1000=5.53500 (USD); Number of Pins: 14; Min Operating Temperature: -40°C; Max Operating Temperature: 85°C; REACH SVHC: No SVHC; ComponentLink1URL: http://www.farnell.com/datasheets/2162814.pdf?src-supplier=Farnell; ComponentLink1Description: http://www.farnell.com/datasheets/2162814.pdf?src-supplier=Farnell; ComponentLink2URL: http://www.farnell.com/datasheets/2162814.pdf?src-supplier=Element14; ComponentLink2Description: http://www.farnell.com/datasheets/2162814.pdf?src-supplier=Element14; ComponentLink3URL: https://datasheets.maximintegrated.com/en/ds/MAX30102.pdf?src-supplier=Digi-Key; ComponentLink3Description: https://datasheets.maximintegrated.com/en/ds/MAX30102.pdf?src-supplier=Digi-Key; Supplier Part Number 1: MAX30102EFD+-ND

## Sheet peripherals.SchDoc
size A
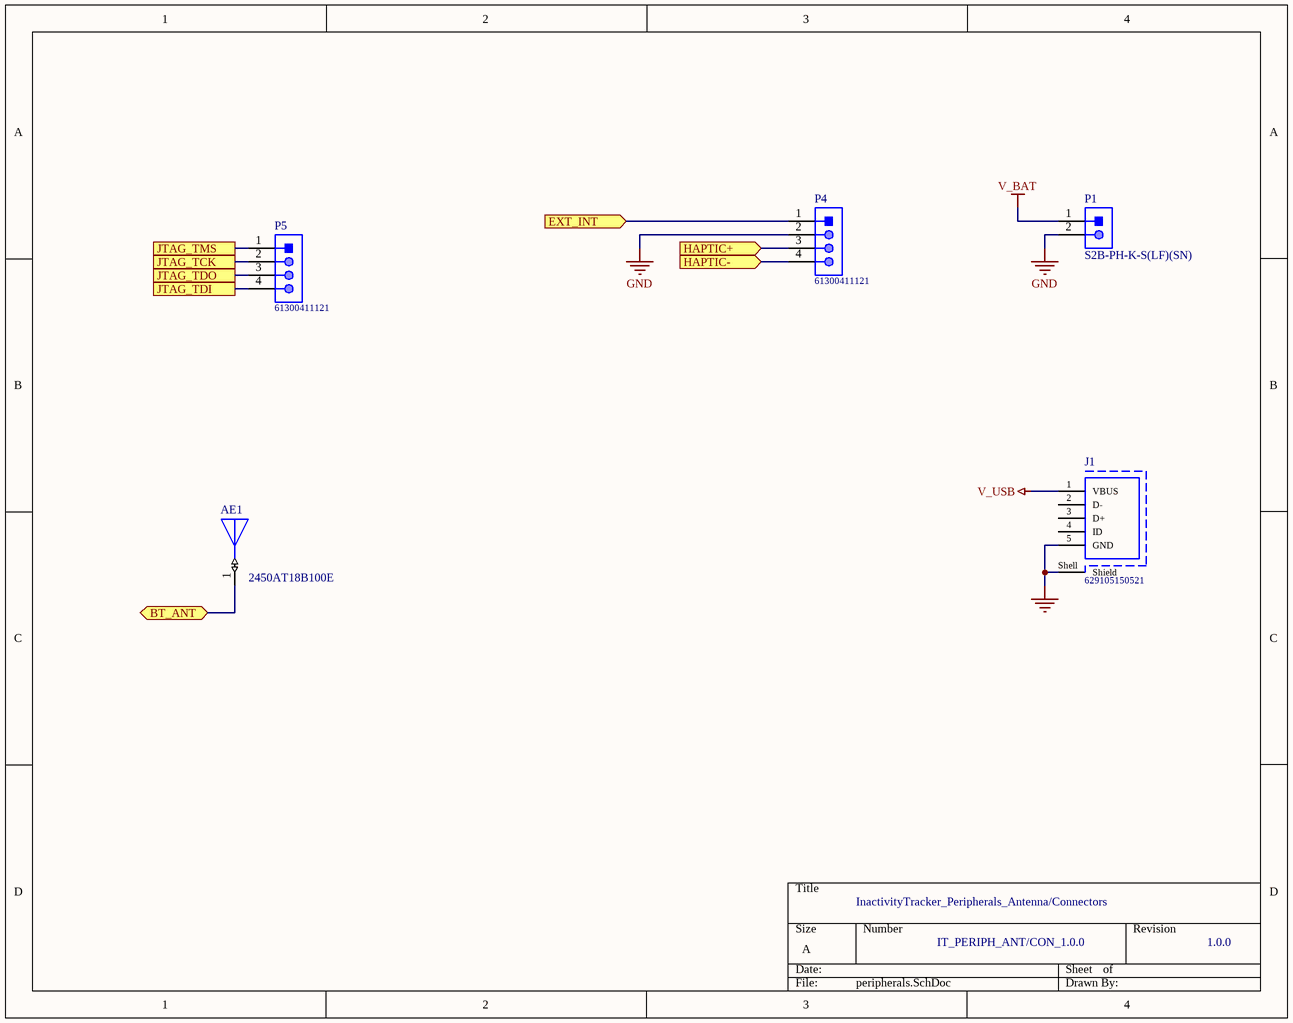
[diagram p4: peripherals.SchDoc]

### Parts
AE1  2450AT18B100E  [ANT_2450AT18B100E]
J1  629105150521  [629105150521]
P1  S2B-PH-K-S(LF)(SN)  [JST-S2B-PH-K-S_V]
P4  61300411121  [61300411121]
P5  61300411121  [61300411121]

### Ports
BT_ANT (bidir), EXT_INT (in), HAPTIC+ (in), HAPTIC- (in), JTAG_TCK, JTAG_TDI, JTAG_TDO, JTAG_TMS

### Nets
GND: J1.5(GND) J1.Shell(Shield) P1.2 P4.2
V_BAT: P1.1
V_USB: J1.1(VBUS)
NetAE1_1: AE1.1 ; port BT_ANT
NetP4_1: P4.1 ; port EXT_INT
NetP4_3: P4.3 ; port HAPTIC+
NetP4_4: P4.4 ; port HAPTIC-
NetP5_1: P5.1 ; port JTAG_TMS
NetP5_2: P5.2 ; port JTAG_TCK
NetP5_3: P5.3 ; port JTAG_TDO
NetP5_4: P5.4 ; port JTAG_TDI

Not connected (* = marked no-connect by the designer): J1 2(D-) 3(D+) 4(ID)

### Notes on the sheet
- InactivityTracker_Peripherals_Antenna/Connectors
- IT_PERIPH_ANT/CON_1.0.0
- 1.0.0

### Library data of the parts
AE1 = 2450AT18B100E: JOHANSON TECHNOLOGY - 2450AT18B100E - ANTENNA, CERAMIC, 2.45GHZ; Number of Bands: 1; Return Loss: -9.5dB; Max Power Dissipation: 3W; Max Frequency: 2.5GHz; Gain: -0.5dB; Impedance: 50R; Bandwidth: 100MHz; Supplier 1: Digi-Key; Manufacturer: Johanson; Manufacturer Part Number: 2450AT18B100E; RoHS: Yes; Category: RF Antennas; Stock 1: 218439; Pricing 1: 1=0.56000, 10=0.49500, 25=0.46520, 100=0.37950, 250=0.35252, 500=0.30000, 1000=0.24000 (USD); Mount: Surface Mount; Case/Package: CSMD; Contact Plating: Tin; Min Operating Temperature: -40°C; Max Operating Temperature: 85°C; Termination: Solder; Frequency: 2.45GHz; Package Quantity: 1; Packaging: Tape and Reel; Power Rating: 3W; Length: 3.2mm; Height: 0.051inch; Width: 1.6mm; Radiation Hardening: No; REACH SVHC: No SVHC; ComponentLink1URL: https://datasheet.ciiva.com/24025/antenna-2450at18b100-242422-24025839.pdf?src-supplier=Mouser; ComponentLink1Description: https://datasheet.ciiva.com/24025/antenna-2450at18b100-242422-24025839.pdf?src-supplier=Mouser; ComponentLink2URL: https://datasheet.ciiva.com/1124/1318299-1124918.pdf?src-supplier=Element14; ComponentLink2Description: https://datasheet.ciiva.com/1124/1318299-1124918.pdf?src-supplier=Element14; Supplier Part Number 1: 712-1006-1-ND
J1 = CMP-1502-03252-1: Micro USB 2.0 Type B Receptacle WR-COM, Horizontal, SMT, with Pegs, High Current at Pin 1 & Pin 5; Manufacturer: Wurth Elektronik; Contact Resistance: 30mOhm; Rated Current: 3A; Working Voltage: 30VAC; Package Reference: 629105150521; Mounting Technology: SMT; Connector Type: MicroUSB2.0TypeB; Operating Temperature: -40to85degC; Orientation: Horizontal; Manufacturer URL: http://www.we-online.de; Datasheet URL: https://katalog.we-online.de/em/datasheet/629105150521.pdf; Part Number: 629105150521; Packaging: TapeandReel; Gender: Receptacle; Publisher: WurthElektronik
P1 = CMP-1755-00004-1: Male Header, Pitch 2 mm, 1 x 2 Position, Height 4.8 mm, Tail Length 3.4 mm, -25 to 85 degC, RoHS, Bulk; Case\Package: Radial; Tolerance: 20%; Capacitance: 10 uF; Voltage Rating (DC): 50 V; Packaging: Bulk; ComponentLink1URL: http://www.jst-mfg.com/product/pdf/eng/ePH.pdf; Radiation Hardening: No; Height: 11 mm; Package Quantity: 200; PackageDescription: Male Header, Pitch 2 mm, 1 x 2 Position, Height 4.8 mm, Tail Length 3.4 mm; PackageReference: S2B-PH-K-S; Diameter: 5 mm; Pins: 2; Mount: Through Hole; Max Operating Temperature: 85 degC; Min Operating Temperature: -40 degC; ComponentLink1Description: Datasheet; DatasheetVersion: Dec-12; Length: 11 mm; Lead Pitch: 2 mm; REACH SVHC: No SVHC; Voltage Rating: 50 V; RoHSCompliant: true
P4 P5 = CMP-1502-01064-1: THT Vertical Pin Header WR-PHD, Pitch 2.54 mm, Single Row, 4 pins; Manufacturer: Wurth Elektronik; Withstanding Voltage: 500VAC; Rated Current: 3A; Working Voltage: 250VAC; Pin Number: 4; Gender: Male; Contact Resistance: 20mOhm; Pitch: 2.54mm; Manufacturer URL: http://www.we-online.de; Operating Temperature: -40to105degC; Packaging: Bag; Mounting Technology: THT; Package Reference: 61300411121; Datasheet URL: https://katalog.we-online.de/em/datasheet/6130xx11121.pdf; Publisher: WurthElektronik; Part Number: 61300411121; Row Number: Single; Orientation: Vertical

## Sheet hid.SchDoc
size A
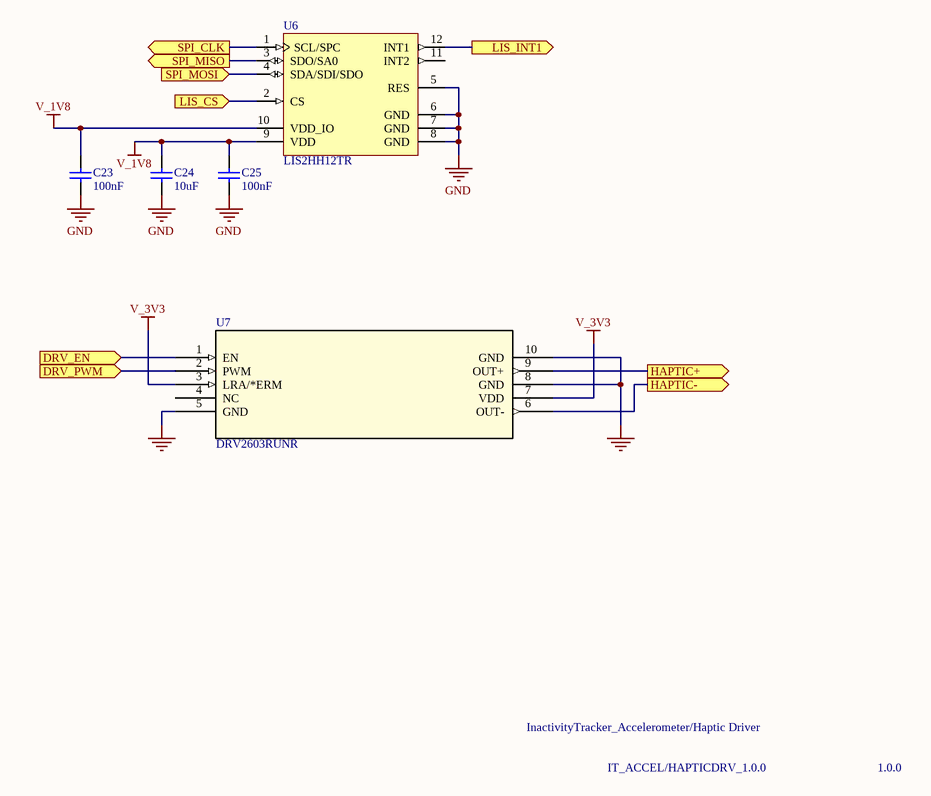
[diagram p5: hid.SchDoc]

### Parts
C23  100nF  [CAPC1005X55X25NL05T10]
C24  10uF  [CAPC1005X55X25NL05T10]
C25  100nF  [CAPC1005X55X25NL05T10]
U6  LIS2HH12TR  [STM-LGA-12]
U7  DRV2603RUNR  [RUN10]

### Ports
DRV_EN (in), DRV_PWM (in), HAPTIC+ (out), HAPTIC- (out), LIS_CS (in), LIS_INT1 (out), SPI_CLK (out), SPI_MISO (out), SPI_MOSI (in)

### Nets
GND: C23.1 C24.2 C25.1 U6.5(RES) U6.6(GND) U6.7(GND) U6.8(GND) U7.5(GND) U7.8(GND) U7.10(GND)
V_1V8: C23.2 C24.1 C25.2 U6.9(VDD) U6.10(VDD_IO)
V_3V3: U7.3(LRA/*ERM) U7.7(VDD)
NetP4_3: U7.9(OUT+) ; port HAPTIC+
NetP4_4: U7.6(OUT-) ; port HAPTIC-
NetP5_4: U7.2(PWM) ; port DRV_PWM
NetU3_7: U6.12(INT1) ; port LIS_INT1
NetU3_10: U7.1(EN) ; port DRV_EN
NetU3_22: U6.3(SDO/SA0) ; port SPI_MISO
NetU3_23: U6.4(SDA/SDI/SDO) ; port SPI_MOSI
NetU3_24: U6.2(CS) ; port LIS_CS
NetU3_25: U6.1(SCL/SPC) ; port SPI_CLK

Not connected (* = marked no-connect by the designer): U6 11(INT2); U7 4(NC)

### Notes on the sheet
- InactivityTracker_Accelerometer/Haptic Driver
- IT_ACCEL/HAPTICDRV_1.0.0
- 1.0.0

### Library data of the parts
C23 C25 = CMP-2008-04639-1: as C9 on sheet mcu
C24 = CMP-2008-04556-1: as C2 on sheet power-dist
U6 = CMP-2000-07462-1: MEMS Digital Output Motion Sensor: Ultra-Low-Power High-Performance 3-Axis "Pico" Accelerometer, 1.71 to 3.6 V, -40 to 85 degC, 12-Pin LGA, RoHS, Tape and Reel; Manufacturer: STMicroelectronics; Bandwidth: 400Hz; Package Description: 12-Pin Land Grid Array Package, Body 2 x 2 mm, Pitch 0.5 mm; Manufacturer URL: http://www.st.com/; Lead Free: LeadFree; Case\/Package: LGA; RoHSCompliant: true; Min Operating Temperature: -40degC; Mounting Technology: SurfaceMount; Packaging: TapeandReel; Max Operating Temperature: 85degC; Mount: SurfaceMount; Number of Pins: 12; Datasheet URL: http://www.st.com/content/ccc/resource/technical/document/datasheet/c9/16/f2/79/ca/31/47/89/DM00096789.pdf/files/DM00096789.pdf/jcr:content/translations/en.DM00096789.pdf; Contact Plating: Gold; Package Reference: LGA-12; Datasheet Version: Rev. 5, 12/2015
U7 = DRV2603RUNR: Motor Driver Power MOSFET Parallel, PWM 10-QFN (2x2); Vendor: Texas Instruments; Built_By: EMA_UL_Team; Manufacturer_Part_Number: DRV2603RUNR; Copyright: Copyright (C) 2018 Accelerated Designs. All rights reserved; RefDes: RefDes; Type: DEV; Value: Value

## Sheet memory.SchDoc
size A
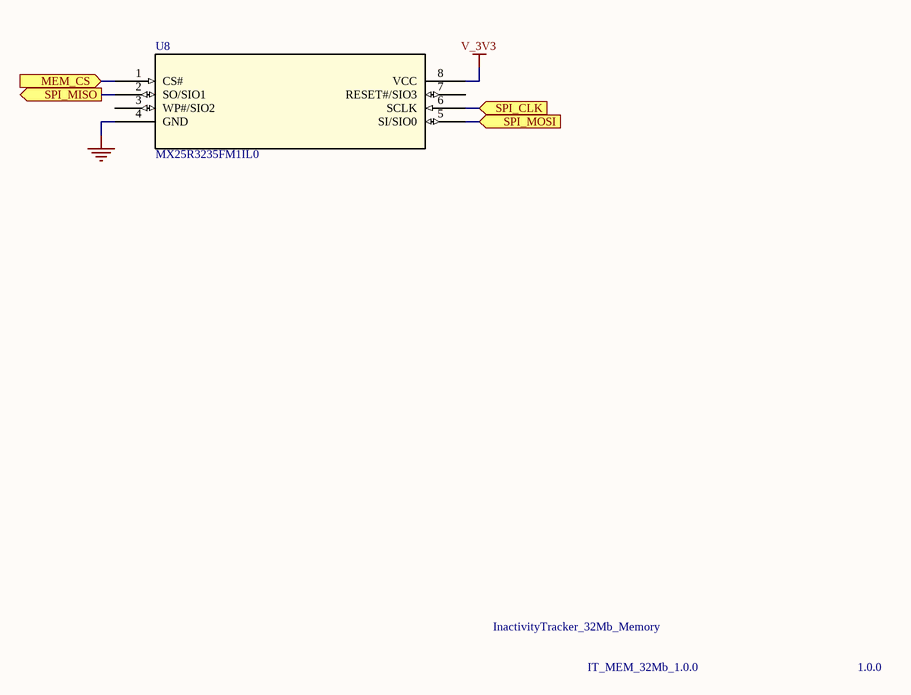
[diagram p6: memory.SchDoc]

### Parts
U8  MX25R3235FM1IL0  [SOP_8L_150]

### Ports
MEM_CS (in), SPI_CLK (in), SPI_MISO (out), SPI_MOSI (in)

### Nets
GND: U8.4(GND)
V_3V3: U8.8(VCC)
NetU3_21: U8.1(CS#) ; port MEM_CS
NetU3_22: U8.2(SO/SIO1) ; port SPI_MISO
NetU3_23: U8.5(SI/SIO0) ; port SPI_MOSI
NetU3_25: U8.6(SCLK) ; port SPI_CLK

Not connected (* = marked no-connect by the designer): U8 3(WP#/SIO2) 7(RESET#/SIO3)

### Notes on the sheet
- InactivityTracker_32Mb_Memory
- IT_MEM_32Mb_1.0.0
- 1.0.0

### Library data of the parts
U8 = MX25R3235FM1IL0: FLASH - NOR Memory IC 32Mb (4M x 8) SPI 80MHz 8-SOP; Vendor: Macronix; Built_By: EMA_Cory; Manufacturer_Part_Number: MX25R3235FM1IL0; Copyright: Copyright (C) 2018 Accelerated Designs. All rights reserved; RefDes: RefDes; Type: DEV; Value: Value

## Nets that join several sheets
GND: mcu (16 pins), power-dist (8 pins), lipo-charger (14 pins), pulseox (P3.6), peripherals (J1.5 J1.Shell P1.2 P4.2), hid (10 pins), memory (U8.4)
V_1V8: power-dist (C1.2 C4.1 L2.2 R17.2), pulseox (P3.4), hid (5 pins)
V_3V3: power-dist (U2.6), pulseox (P3.3), hid (U7.3 U7.7), memory (U8.8)
V_BAT: lipo-charger (R1.1 U4.14 U4.15 U4.16), peripherals (P1.1)
V_MCU: mcu (FB1.2), power-dist (C3.1 L1.2 U2.4 U2.5)
V_SYS: power-dist (10 pins), lipo-charger (C19.1 U4.1 U4.20)
V_USB: lipo-charger (8 pins), peripherals (J1.1)
NetAE1_1: mcu (C6.1), peripherals (AE1.1)
NetP3_1: mcu (U3.26), pulseox (P3.1)
NetP3_2: mcu (U3.27), pulseox (P3.2)
NetP3_5: mcu (U3.8), pulseox (P3.5)
NetP4_1: mcu (U3.9), peripherals (P4.1)
NetP4_3: peripherals (P4.3), hid (U7.9)
NetP4_4: peripherals (P4.4), hid (U7.6)
NetP5_1: mcu (U3.13), peripherals (P5.1)
NetP5_2: mcu (U3.14), peripherals (P5.2)
NetP5_3: mcu (U3.15), peripherals (P5.3)
NetP5_4: mcu (U3.16), peripherals (P5.4), hid (U7.2)
NetR1_2: mcu (U3.6), lipo-charger (R1.2 R14.1)
NetR11_1: mcu (R11.1 U3.20), lipo-charger (U4.6)
NetU3_7: mcu (U3.7), hid (U6.12)
NetU3_10: mcu (U3.10), hid (U7.1)
NetU3_21: mcu (U3.21), memory (U8.1)
NetU3_22: mcu (U3.22), hid (U6.3), memory (U8.2)
NetU3_23: mcu (U3.23), hid (U6.4), memory (U8.5)
NetU3_24: mcu (U3.24), hid (U6.2)
NetU3_25: mcu (U3.25), hid (U6.1), memory (U8.6)